# EAGLE design TeleinfoMySensors (EAGLE 7.5.0)
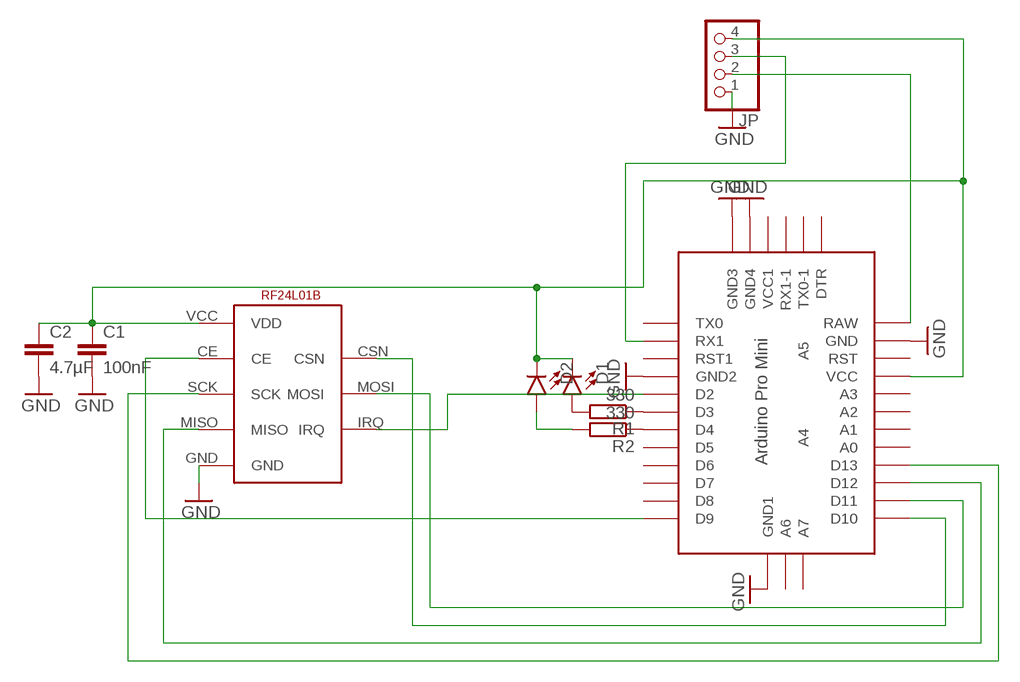
[diagram p0: schematic, sheet 1]

## Parts
C1  100nF  C-EUC1206  [C1206]
C2  4.7µF  C-EUC1210  [C1210]
D1  LED1206  [LED-1206]
D2  LED1206  [LED-1206]
JP  PINHD-1X4  [1X04]
NRF  NRF24L01BLACK  [24L01BLACK]
R1  330  R-EU_M1206  [M1206]
R2  330  R-EU_M1206  [M1206]
U$1  ABK-PRO-MINI  [ABK-PRO-MINI]

## Nets
GND: C1.2 C2.2 JP.1 NRF.GND U$1.GND U$1.GND1(GND2) U$1.GND2(GND3) U$1.GND3(GND4) U$1.GND4(GND1)
N$1: NRF.CE U$1.D9
N$2: D1.A R1.2
N$3: NRF.SCK U$1.D13
N$4: R1.1 U$1.D3
N$6: NRF.MOSI U$1.D11
N$7: NRF.MISO U$1.D12
N$8: JP.2 U$1.RAW
N$9: R2.1 U$1.D4
N$11: D2.A R2.2
N$12: JP.3 U$1.RX1
N$14: C1.1 C2.1 D1.C D2.C JP.4 NRF.VCC(VDD) U$1.VCC
N$18: NRF.IRQ U$1.D2
N$19: NRF.CSN U$1.D10
Unconnected: U$1.A0 U$1.A1 U$1.A2 U$1.A3 U$1.A4 U$1.A5 U$1.A6 U$1.A7 U$1.D5 U$1.D6 U$1.D7 U$1.D8 U$1.DTR U$1.RST U$1.RST1 U$1.RX1-1 U$1.TX0 U$1.TX0-1 U$1.VCC1

## Library data of the parts
C1 C2 = rcl:C-EU: CAPACITOR, European symbol
D1 D2 = SparkFun-LED:LED: LED (Generic) Standard schematic elements and footprints for 5mm, 3mm, 1206, and 0603 sized LEDs. Generic LEDs with no color specified.
JP = pinhead:PINHD-1X4: PIN HEADER
NRF = nrf24l01:NRF24L01BLACK
R1 R2 = rcl:R-EU_: RESISTOR, European symbol
U$1 = Arduino-clone:ABK-PRO-MINI: ABK Pro-Mini Arduino Clone

## Board
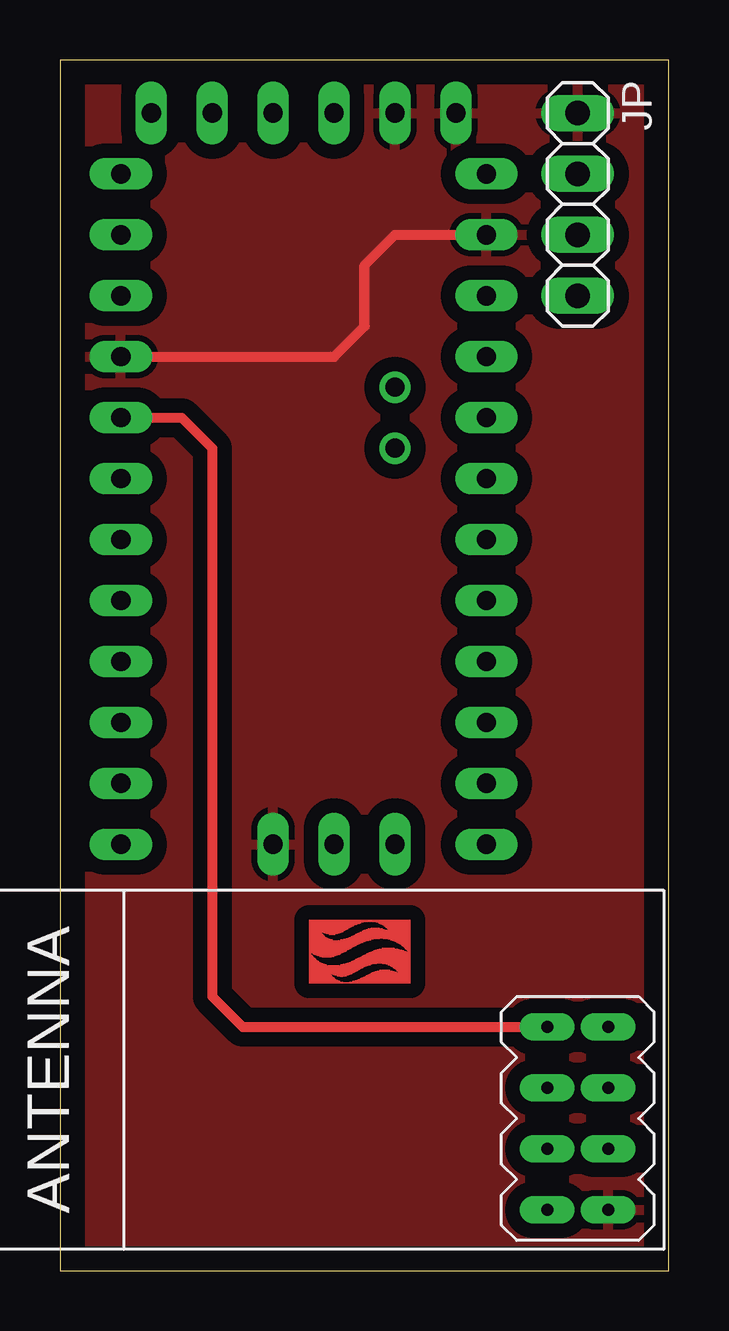
[diagram p1: board, top side]
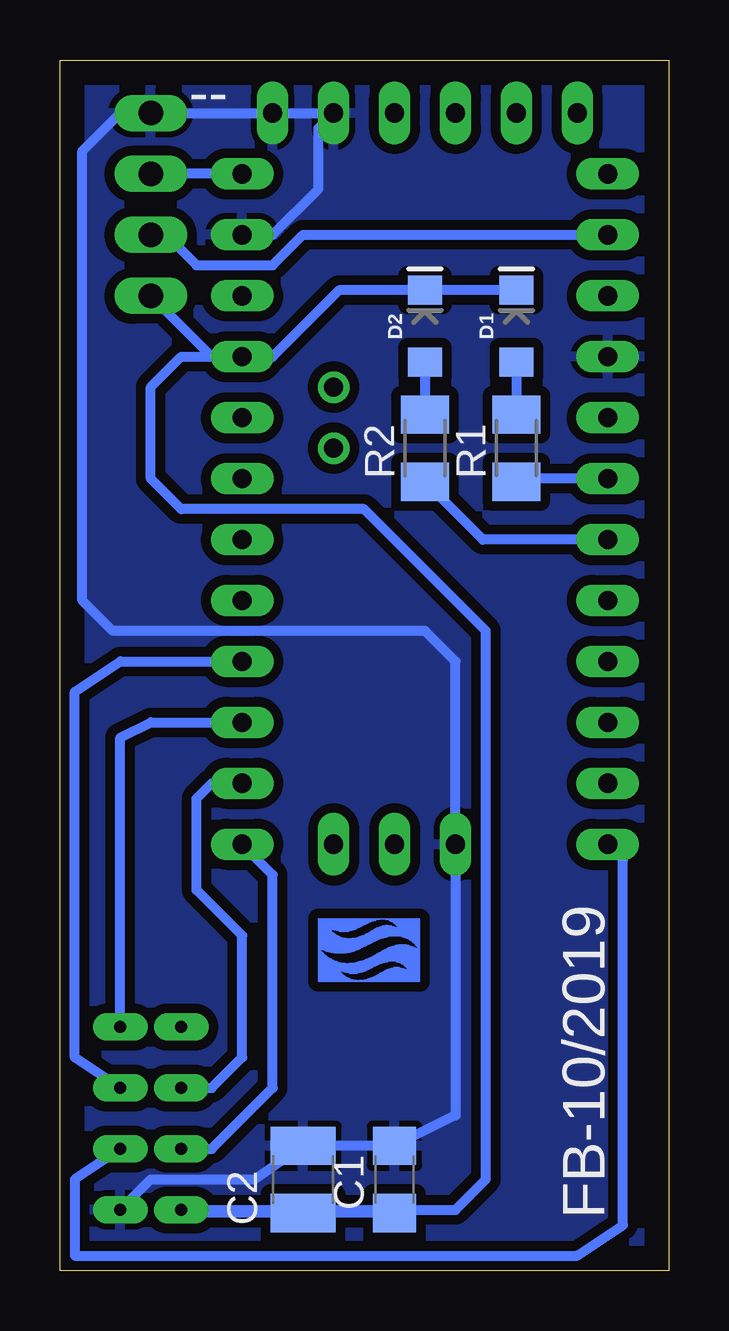
[diagram p2: board, bottom side, seen from below]

Size 25.38 x 50.47 mm. Coordinates in mm from the lower left corner, seen from the top.
Outline: 0,0 25.38,0 25.38,50.47 0,50.47 0,0
Copper layers (1*16): Top 0.035mm / dielectric 1.5mm / Bottom 0.035mm
Design rules "default": minimum track width 10mil, minimum drill 24mil, track to track 8mil, track to pad 8mil, pad to pad 8mil, via to via 8mil, smd to smd 8mil, copper to edge 40mil, drill to drill 8mil, minimum pad ring 10mil, minimum via ring 8mil, stop-mask expansion 4mil, vias tented up to drill 0mil, thermal gap 10mil

### Footprints (pad centres in the part's own frame; a part is rotated, then mirrored left to right if it is on the bottom)
C1206 = smd 1.6 x 1.8: 1 -1.4,0; 2 1.4,0
C1210 = smd 1.6 x 2.7: 1 -1.4,0; 2 1.4,0
LED-1206 = smd 1.2 x 1.4: A -1.5,0; C 1.5,0
1X04 = drill 1.016 long: 1 -3.81,0; 2 -1.27,0; 3 1.27,0; 4 3.81,0
24L01BLACK = drill 0.5 pad 1.143 long: CE -10.795,2.54; CSN -8.255,2.54; GND -10.795,5.08; IRQ -8.255,-2.54; MISO -10.795,-2.54; MOSI -8.255,0; SCK -10.795,0; VCC -8.255,5.08
M1206 = smd 1.6 x 2: 1 -1.4,0; 2 1.4,0
ABK-PRO-MINI = drill 0.8 long: A0 10.16,-11.43; A1 10.16,-8.89; A2 10.16,-6.35; A3 10.16,-3.81; A6 3.81,-21.59; A7 6.35,-21.59; D2 -5.08,-3.81; D3 -5.08,-6.35; D4 -5.08,-8.89; D5 -5.08,-11.43; D6 -5.08,-13.97; D7 -5.08,-16.51; D8 -5.08,-19.05; D9 -5.08,-21.59; D10 10.16,-21.59; D11 10.16,-19.05; D12 10.16,-16.51; D13 10.16,-13.97; DTR -3.81,8.89; GND 10.16,3.81; GND1 -5.08,-1.27; GND2 8.89,8.89; GND3 6.35,8.89; GND4 1.27,-21.59; RAW 10.16,6.35; RST 10.16,1.27; RST1 -5.08,1.27; RX1 -5.08,3.81; RX1-1 1.27,8.89; TX0 -5.08,6.35; TX0-1 -1.27,8.89; VCC 10.16,-1.27; VCC1 3.81,8.89 | drill 0.8: A4 6.35,-5.08; A5 6.35,-2.54

### Placement (x,y rotation side)
C1  11.43,3.81 90 bottom
C2  15.24,3.81 90 bottom
D1  6.35,39.37 90 bottom
D2  10.16,39.37 90 bottom
JP  21.59,44.45 270 top
NRF  12.07,7.62 180 top
R1  6.35,34.29 90 bottom
R2  10.16,34.29 90 bottom
U$1  7.62,39.37 0 top
U$3  [FB]  14.61,12.06 90 top
U$4  [FB]  14.61,14.6 270 bottom

### Tracks (layer width: path | path; a pad name or v marks a point on that pad's centre or on a via)
GND
  Top 0.406: U$1.GND1 11.43,38.1 12.7,39.37 12.7,41.91 13.97,43.18 U$1.GND
  Bottom 0.406: NRF.GND 21.59,3.81 17.27,3.81 C2.2 C1.2 8.89,6.48 U$1.GND4 8.89,25.4 10.16,26.67 23.18,26.67 24.45,27.94 24.45,46.67 22.86,48.26 JP.1 U$1.GND2 U$1.GND3 14.61,47.62 14.61,45.09 16.51,43.18 U$1.GND
  pour Bottom (isolate 0.406): 0,50.16 25.4,50.16 25.4,0 0,0
  pour Top (isolate 0.61): 0,50.16 25.4,50.16 25.4,0 0,0
N$1
  Bottom 0.406: NRF.CE 24.76,3.81 24.76,0.63 3.81,0.63 1.91,1.9 1.91,17.14 U$1.D9
N$2
  Bottom 0.406: D1.A R1.2
N$3
  Bottom 0.406: NRF.SCK 24.76,8.89 24.76,24.13 22.86,25.4 U$1.D13
N$4
  Bottom 0.406: U$1.D3 6.22,33.02 R1.1
N$6
  Bottom 0.406: NRF.MOSI 19.05,7.62 17.78,8.89 17.78,13.97 19.68,15.87 19.68,19.68 19.05,20.32 U$1.D11
N$7
  Bottom 0.406: NRF.MISO 22.86,22.23 21.59,22.86 U$1.D12
N$8
  Bottom 0.406: U$1.RAW JP.2
N$9
  Bottom 0.406: U$1.D4 7.75,30.48 R2.1
N$11
  Bottom 0.406: 10.16,36.83 R2.2 D2.A
N$12
  Bottom 0.406: JP.3 20.95,43.18 19.68,41.91 16.51,41.91 15.24,43.18 U$1.RX1
N$14
  Bottom 0.406: C1.1 C2.1 19.55,2.41 NRF.VCC 8.89,2.54 7.62,3.81 7.62,26.67 12.7,31.75 20.32,31.75 21.59,33.02 21.59,36.83 20.32,38.1 U$1.VCC | U$1.VCC 19.05,38.1 JP.4 | D1.C D2.C 13.74,40.87 16.51,38.1 U$1.VCC
N$18
  Top 0.406: U$1.D2 5.08,35.56 6.35,34.29 6.35,11.43 7.62,10.16 NRF.IRQ
N$19
  Bottom 0.406: NRF.CSN 19.05,5.08 16.51,7.62 16.51,16.51 U$1.D10

### Text on the board
bNames: -- | FB-10/2019